# Altium project Auto Plant Controller V2 - SMT_MCU.PrjPcb
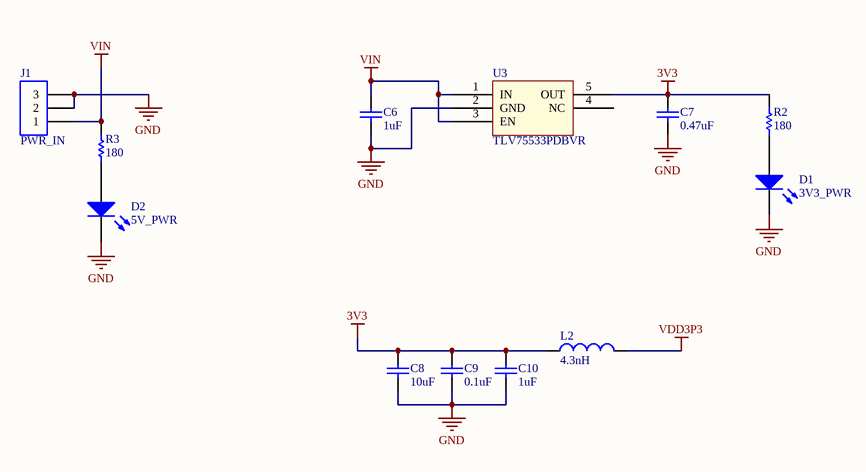
[diagram p0: Vreg.SchDoc]
5 sheets, 51 parts. Net scope: global (net labels, ports and power ports of the same name join across sheets).
Sheets:
  Vreg.SchDoc
  ESP8285.SchDoc
  ADC_MUX.SchDoc
  WifiAntenna.SchDoc
  Connectors.SchDoc

## Sheet Vreg.SchDoc
size A

### Parts
C6  1uF  [C0805]
C7  0.47uF  [CAPC1608X90X35ML15T15]
C8  10uF  [PCB-3l8viaoeo84t9gm70k7i-1]
C9  0.1uF  [PCB-oygqt4xf3sesynjclq4r-1]
C10  1uF  [C0805]
D1  3V3_PWR  [PCB-1544848-1]
D2  5V_PWR  [DIOM1608X06N]
J1  PWR_IN  [ADAM-ADC-002-3_V]
L2  4.3nH  [PCB-vetezry5jn2cqs6s1af8-1]
R2  180  [RESC2013X60X30NL20T20]
R3  180  [RESC2013X60X30NL20T20]
U3  TLV75533PDBVR  [PCB-9xapb279xxlk04njnstk-1]

### Nets
3V3: C7.2 C8.2 C9.2 C10.1 L2.1 R2.2 U3.5(OUT)
GND: C6.2 C7.1 C8.1 C9.1 C10.2 D1.2(K) D2.K J1.2 J1.3 U3.2(GND)
VDD3P3: L2.2
VIN: C6.1 J1.1 R3.2 U3.1(IN) U3.3(EN)
NetD1_1: D1.1(A) R2.1
NetD2_A: D2.A R3.1

Not connected (* = marked no-connect by the designer): U3 4(NC)

### Library data of the parts
C6 C10 = CMP-77c3bc4dc880a804-3: 0805 1 uF 25 V ±10 % Tolerance X7R SMT Multilayer Ceramic Capacitor; Manufacturer Part Number: CC0805KKX7R8BB105; Lead-Free Status: Lead Free; Voltage Rating (DC): 25.0 V; Capacitance Tolerance: ±10%; Octopart Url: http://octopart.com/cc0805kkx7r8bb105-yageo-42244645; Seller Landing  Url: https://octopart-clicks.com/click/track?country=US&ak=8157f166&sig=04b9cde&sid=5489&ppid=42244645&vpid=127579773&ct=offers; Number of Pins: 2; Mounting Style: Surface Mount; Packaging: Cut Tape (CT); Case/Package: 0805; REACH SVHC Compliance: No SVHC; RoHS: Compliant; Halogen Free Status: Halogen Free; Capacitance: 1uF; OctopartID: 77c3bc4dc880a804; Dielectric Characteristic: X7R
C7 = CMP-55ff9c78cd6f8a38-1: CL10 Series 0.47 uF 16 V ±10 % Tolerance X7R SMT Multilayer Ceramic Capacitor; RoHS: Compliant
C8 = CMP-5e7a9647d7d381bd-6: Cap Ceramic 10uF 25V X5R 10% SMD 0805 85C Paper T/R; Manufacturer Part Number: TMK212BBJ106KG-T; Octopart URL: http://octopart.com/tmk212bbj106kg-t-taiyo+yuden-20425935; Dielectric Characteristic: X5R
C9 = CMP-2758844-5: 0.1uF, ±10%, 50V, X7R, 0805, Multilayer Ceramic Capacitor; Manufacturer Part Number: CL21B104KBCNNNC; Lead-Free Status: Lead Free; Voltage Rating (DC): 50.0 V; Capacitance: 100 nF; Operating Temperature: -55.0 °C (min); RoHS: Compliant; Octopart URL: https://octopart.com/cl21b104kbcnnnc-samsung-9299352; Mounting Style: Surface Mount; Case/Package: 0805; Dielectric Characteristic: X7R; OctopartID: 94265da154d84be1
D1 = CMP-1f66d74e5acac0a1-1: Blue 1.6 x 0.8 x 0.3 mm 130° Clear 180 mcd 3.8 V Surface Mount LED; Manufacturer Part Number: LTST-C194TBKT; Lead-Free Status: Lead Free; Case/Package: 0603; Packaging: Reel
D2 = CMP-1544848-9: LED; SMD; 0603; red; 18-54mcd; 1.6x0.8x0.55mm; 130°; 2÷2.4V; 20mA; Wavelength: 639 nm; Case/Package (SI): 1608; Luminous Intensity: 54.0 mcd; Lead-Free Status: Lead Free; Color: Red; RoHS: Compliant; Packaging: Tape & Reel (TR), Cut Tape (CT); Operating Temperature: 85.0 °C (max); Mounting Style: Surface Mount, Vertical; Viewing Angle: 130 °; Size-Height: 550 µm
J1 = CMP-3153101-9: DC Power Connectors DC POWER JACK 2.5MM PIN TYPE 002; Manufacturer Part Number: ADC-002-2; Octopart Url: https://octopart.com/adc-002-2-adam+tech-55509430; OctopartID: 975d5d18b38d489a; Orientation: Right Angle
L2 = CMP-e5012c7543d03ac6-1: Surface Mount High Frequency Inductor, LQW15AN Series, 4.3 nH, 0.1nH, 0402 [1005 Metric], 10 GHz; Manufacturer Part Number: LQW15AN4N3B00D; Lead-Free Status: Lead Free; Inductance: 4.30 nH; Lifecycle Status: Active; Octopart URL: http://octopart.com/lqw15an4n3b00d-murata-8291255; Packaging: Cut Tape (CT); Case/Package: 0402, 1005; RoHS: Compliant; REACH SVHC Compliance: No SVHC; OctopartID: e5012c7543d03ac6
R2 R3 = CMP-3657049-2: Thick Film Resistors - SMD 1/8watts 180ohms 1%; Manufacturer Part Number: RK73H2ATTD1800F; Lead-Free Status: Lead Free; Power Rating: 0.125 W; Resistance: 180.0 Ω; Case/Package: 0805; Mounting Style: Surface Mount; Octopart Url: https://octopart.com/rk73h2attd1800f-koa+speer-15007961; OctopartID: af1966f68aa670de; Resistance Tolerance: ±1%; RoHS: Compliant
U3 = CMP-a508697234f37acf-1: 500-mA low-IQ small-size low-dropout (LDO) regulator 5-SOT-23 -40 to 125; Quiescent Current: 25.0 µA; Output Capacitor Type: Ceramic; Dropout Voltage: 220 mV; Number of Regulated Outputs: 1; Case/Package: SOT-23; Lifecycle Status: Pre-Release; Octopart URL: https://octopart.com/tlv75533pdbvr-texas+instruments-91272349; OctopartID: a508697234f37acf; Operating Temperature: -40.0 °C to 125 °C; RoHS: Compliant; Number of Pins: 5; Manufacturer Part Number: TLV75533PDBVR

## Sheet ESP8285.SchDoc
size A; SheetNumber: 1
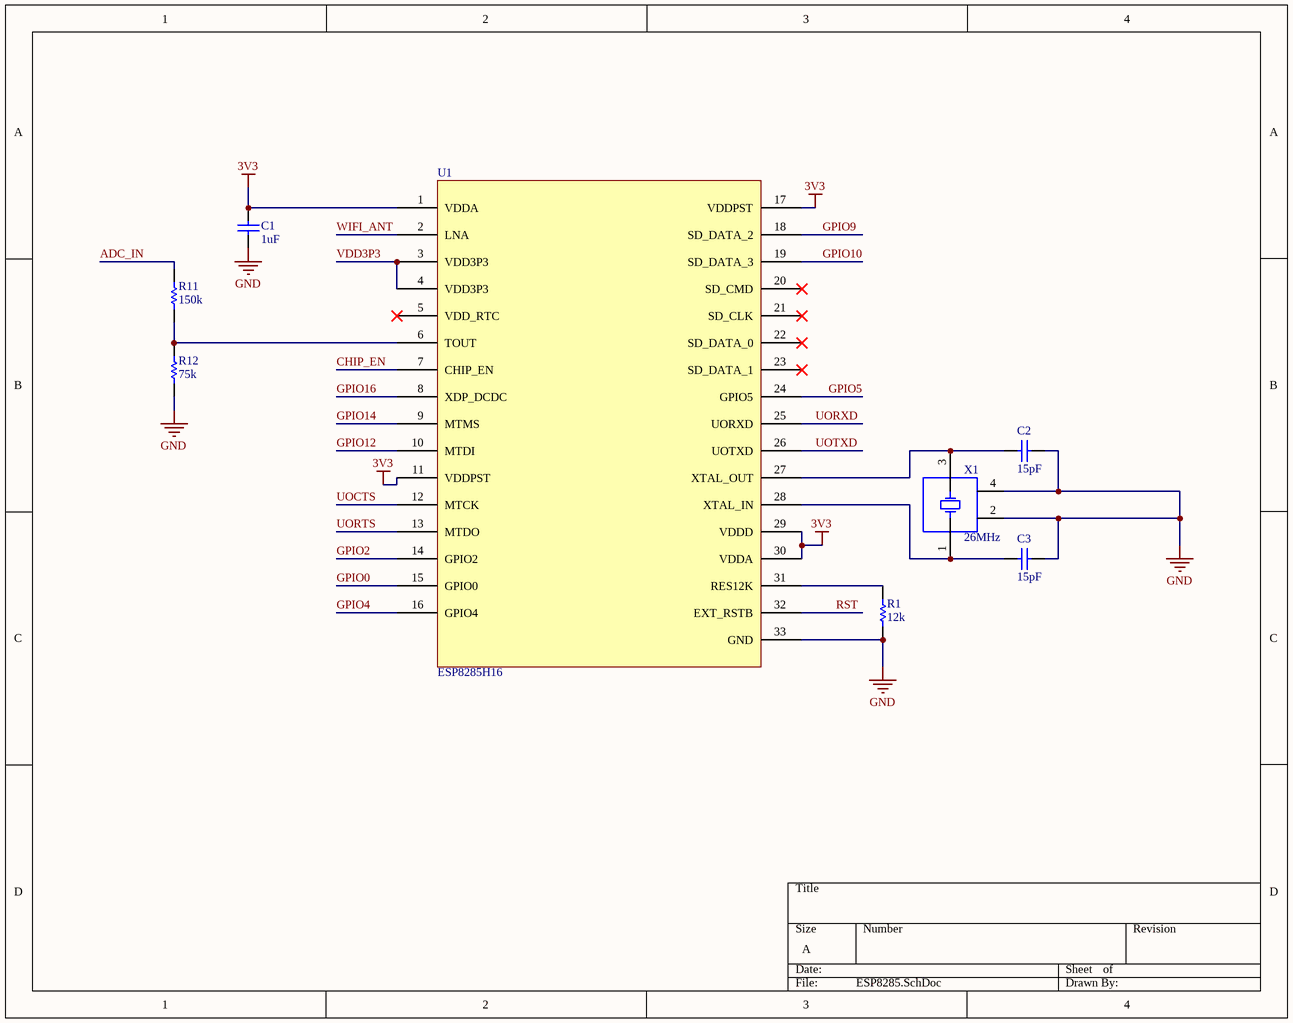
[diagram p1: ESP8285.SchDoc]

### Parts
C1  1uF  [C0805]
C2  15pF  [PCB-98fz84kwkqgd8opjlb99-1]
C3  15pF  [PCB-98fz84kwkqgd8opjlb99-1]
R1  12k  [RESC1609X50X30LL10T20]
R11  150k  [RESC1608X55X30LL15T15]
R12  75k  [RESC1608X55X30LL15T15]
U1  ESP8285H16  [PCB-1fh2hqe1x48mh17li7t6-1]
X1  26MHz  [PCB-1zhjv6m1p58g6yr6i7sc-1]

### Nets
3V3: C1.1 U1.1(VDDA) U1.11(VDDPST) U1.17(VDDPST) U1.29(VDDD) U1.30(VDDA)
GND: C1.2 C2.2 C3.2 R1.1 R12.1 U1.33(GND) X1.2 X1.4
VDD3P3: U1.3(VDD3P3) U1.4(VDD3P3)
ADC_IN: R11.2
CHIP_EN: U1.7(CHIP_EN)
GPIO0: U1.15(GPIO0)
GPIO2: U1.14(GPIO2)
GPIO4: U1.16(GPIO4)
GPIO5: U1.24(GPIO5)
GPIO9: U1.18(SD_DATA_2)
GPIO10: U1.19(SD_DATA_3)
GPIO12: U1.10(MTDI)
GPIO14: U1.9(MTMS)
GPIO16: U1.8(XDP_DCDC)
RST: U1.32(EXT_RSTB)
UOCTS: U1.12(MTCK)
UORTS: U1.13(MTDO)
UORXD: U1.25(UORXD)
UOTXD: U1.26(UOTXD)
WIFI_ANT: U1.2(LNA)
NetC2_1: C2.1 U1.27(XTAL_OUT) X1.3
NetC3_1: C3.1 U1.28(XTAL_IN) X1.1
NetR1_2: R1.2 U1.31(RES12K)
NetR11_1: R11.1 R12.2 U1.6(TOUT)

Not connected (* = marked no-connect by the designer): U1 5(VDD_RTC)* 20(SD_CMD)* 21(SD_CLK)* 22(SD_DATA_0)* 23(SD_DATA_1)*

### Library data of the parts
C1 = CMP-77c3bc4dc880a804-3: as C6 on sheet Vreg; Octopart Url: http://octopart.com/cc0805kkx7r8bb105-yageo-42244645; Seller Landing  Url: https://octopart-clicks.com/click/track?country=US&ak=8157f166&sig=04b9cde&sid=5489&ppid=42244645&vpid=127579773&ct=offers; Number of Pins: 2; Mounting Style: Surface Mount; Packaging: Cut Tape (CT); Case/Package: 0805; REACH SVHC Compliance: No SVHC; RoHS: Compliant; Halogen Free Status: Halogen Free; Capacitance: 1uF; OctopartID: 77c3bc4dc880a804; Dielectric Characteristic: X7R
C2 C3 = CMP-a0ab688c22207f6c-1: 15pF ±1% 50V C0G, NP0 Ceramic Capacitor -55°C ~ 125°C Surface Mount, MLCC 0402 (1005 Metric) 0.039" L x 0.020" W (1.00mm x 0.50mm); Manufacturer Part Number: GRM1555C1H150FA01D; Manufacturer: Murata Electronics North America; Vendor Part Number: 490-6200-1-ND; Manufacturer Part Number, Other: 490-6200-1; Category: Capacitors; Family: Digikey; Capacitance: 15pF; Cost: Ceramic Capacitors; Tolerance: ±1%; Thickness (Max): 0.022" (0.55mm); Octopart URL: http://octopart.com/grm1555c1h150fa01d-murata-19769325; OctopartID: a0ab688c22207f6c; Operating Temperature: -55°C ~ 125°C; Size / Dimension: 0.039" L x 0.020" W (1.00mm x 0.50mm); Temperature Coefficien: C0G, NP0; Mounting Type: Surface Mount, MLCC; Applications: General Purpose; Package / Case: 0402 (1005 Metric); Voltage - Rated: 50V
R1 = CMP-1857522-10: Res Thick Film 0603 12K Ohm 1% 0.1W(1/10W) ±100ppm/C Molded SMD Automotive Paper T/R
R11 = CMP-3654711-2: Thick Film Resistors - SMD 0603 150Kohms 1% Tol; Manufacturer Part Number: ERJ-3EKF1503V; Lead-Free Status: Lead Free; Power Rating: 0.1 W; Resistance: 150000.0 Ω; Voltage Rating (DC): 75.0 V; Case/Package: 0603; Lifecycle Status: Not Listed by Manufacturer; Mounting Style: Surface Mount; Number of Pins: 2; Octopart Url: https://octopart.com/erj-3ekf1503v-panasonic-55421489; OctopartID: de4c140b511b018b; REACH SVHC Compliance: No SVHC; Resistance Tolerance: ±1%; RoHS: Compliant; Size-Height: 0.00045 m; Size-Length: 0.0016 m; Size-Width: 0.0008 m
R12 = CMP-3654871-2: Thick Film Resistors - SMD 0603 75Kohms 1% Tol; Manufacturer Part Number: ERJ-3EKF7502V; Lead-Free Status: Lead Free; Power Rating: 0.1 W; Resistance: 75000.0 Ω; Voltage Rating (DC): 75.0 V; Case/Package: 0603; Lifecycle Status: Not Listed by Manufacturer; Mounting Style: Surface Mount; Octopart Url: https://octopart.com/erj-3ekf7502v-panasonic-55421908; OctopartID: 327df83abccfedba; Packaging: Cut Tape (CT); REACH SVHC Compliance: No SVHC; Resistance Tolerance: ±1%; RoHS: Compliant; Size-Height: 0.00045 m; Size-Length: 0.0016 m; Size-Width: 0.0008 m
U1 = CMP-265ae9019d32f99d-2: RF Transceiver 64QAM/BPSK/CCK/DSSS/OFDM 2.7V to 3.6V 2400MHz to 2483.5MHz 32-Pin QFN; Manufacturer Part Number: ESP8285H16; OctopartID: 265ae9019d32f99d; Octopart URL: https://octopart.com/esp8285h16-espressif+systems-106012174
X1 = CMP-932d5a23796e4cea-3: Crystal 26MHz ±10ppm (Tol) ±10ppm (Stability) 10pF FUND 50Ohm 4-Pin CSMD T/R; Manufacturer Part Number: ABM8-26.000MHZ-10-1-U-T; Frequency: 26.0 MHz; Packaging: Cut Tape (CT); Size-Length: 3.20 mm

## Sheet ADC_MUX.SchDoc
size A
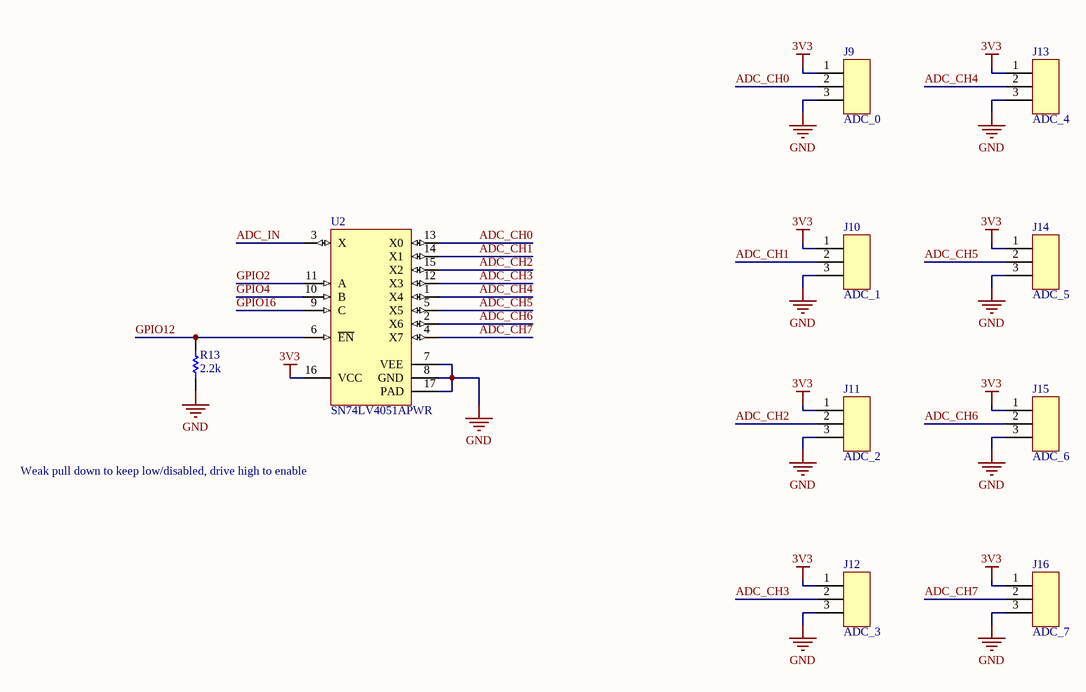
[diagram p2: ADC_MUX.SchDoc]

### Parts
J9  ADC_0  [PCB-s0hfil65plaomi4ibvcw-1]
J10  ADC_1  [PCB-s0hfil65plaomi4ibvcw-1]
J11  ADC_2  [PCB-s0hfil65plaomi4ibvcw-1]
J12  ADC_3  [PCB-s0hfil65plaomi4ibvcw-1]
J13  ADC_4  [PCB-s0hfil65plaomi4ibvcw-1]
J14  ADC_5  [PCB-s0hfil65plaomi4ibvcw-1]
J15  ADC_6  [PCB-s0hfil65plaomi4ibvcw-1]
J16  ADC_7  [PCB-s0hfil65plaomi4ibvcw-1]
R13  2.2k  [PCB-2t5lv6a742zfbi3344hk-1]
U2  SN74LV4051APWR  [PCB-s2tlwx05pg4l7j3eq4ax-1]

### Nets
3V3: J9.1 J10.1 J11.1 J12.1 J13.1 J14.1 J15.1 J16.1 U2.16(VCC)
GND: J9.3 J10.3 J11.3 J12.3 J13.3 J14.3 J15.3 J16.3 R13.1 U2.7(VEE) U2.8(GND) U2.17(PAD)
ADC_CH0: J9.2 U2.13(X0)
ADC_CH1: J10.2 U2.14(X1)
ADC_CH2: J11.2 U2.15(X2)
ADC_CH3: J12.2 U2.12(X3)
ADC_CH4: J13.2 U2.1(X4)
ADC_CH5: J14.2 U2.5(X5)
ADC_CH6: J15.2 U2.2(X6)
ADC_CH7: J16.2 U2.4(X7)
ADC_IN: U2.3(X)
GPIO2: U2.11(A)
GPIO4: U2.10(B)
GPIO12: R13.2 U2.6(~{EN})
GPIO16: U2.9(C)

### Notes on the sheet
- Weak pull down to keep low/disabled, drive high to enable

### Library data of the parts
J9-J16 = CMP-8a90426ffa175557-34: THT Vertical Pin Header WR-PHD, Pitch 2.54 mm, Single Row, 3 pins; Lead-Free Status: Lead Free; Dielectric Withstanding Voltage: 500 V; Orientation: Vertical
R13 = CMP-ce770211389311b0-1: Res, AEC-Q200, Thick Film, 2K2, 5%, 0603; Manufacturer Part Number: CRGCQ0603J2K2; Lifecycle Status: Not Listed by Manufacturer; Octopart URL: https://octopart.com/crgcq0603j2k2-te+connectivity-91018114; Packaging: Cut Tape (CT); Resistance Tolerance: ±5%; OctopartID: ce770211389311b0
U2 = CMP-2f9ae6973f1af05d-4: 5-V, 8: 1, 1-channel general-purpose analog multiplexer 16-TSSOP -40 to 85; Number of Circuits: 1; Polarity: Non-Inverting; Supply Current: 20.0 µA; Number of Channels: 8; Bandwidth: 35.0 MHz; Propagation Delay Max (tpd): 7.00 ns; Voltage Nodes: 5.00 V, 3.30 V, 2.50 V; Lead-Free Status: Lead Free; Quiescent Current: 20.0 µA (max); Supply Voltage (DC): 2.00 V to 5.50 V; OctopartID: 2f9ae6973f1af05d; Operating Temperature: 85.0 °C (max); Number of Pins: 16; Case/Package: TSSOP; Packaging: Cut Tape (CT), Tape & Reel (TR); REACH SVHC Compliance: No SVHC; Lifecycle Status: Active; Number of Bits: 8; RoHS: Compliant; Manufacturer Part Number: SN74LV4051APWR; Mounting Style: Surface Mount; Octopart URL: https://octopart.com/sn74lv4051apwr-texas+instruments-472550

## Sheet WifiAntenna.SchDoc
size A
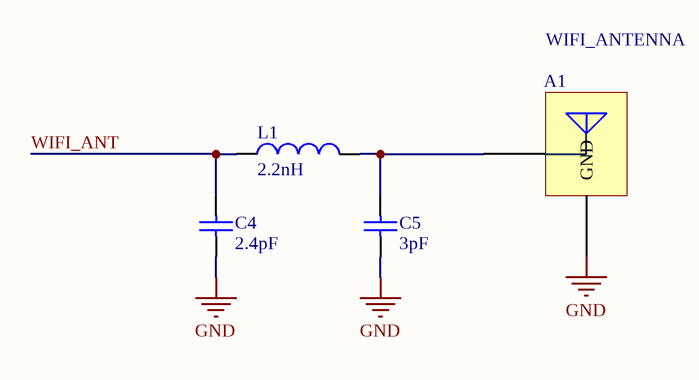
[diagram p3: WifiAntenna.SchDoc]

### Parts
A1  WIFI_ANTENNA  [PCB-wx81mnio3p969u8b8u4u-1]
C4  2.4pF  [CAPC1005X55X25ML05T10]
C5  3pF  [CAPC1005X55X25ML05T10]
L1  2.2nH  [PCB-vg5vda2wcniu3fh2gltx-1]

### Nets
GND: A1.2(GND) C4.1 C5.1
WIFI_ANT: C4.2 L1.1
NetA1_1: A1.1(A) C5.2 L1.2

### Library data of the parts
A1 = CMP-nvfputv9e4hvqhxbgt68-5: Meandered Inverted-F Antenna; CustomComponentID: nvfputv9e4hvqhxbgt68
C4 = CMP-119517-2: CAP CER 2.4PF 50V NP0 0402; Manufacturer Part Number: GJM1555C1H2R4CB01D; Capacitance: 2.4e-12 F; Dielectric Characteristic: C0G/NP0; Lead-Free Status: Lead Free; Voltage Rating (DC): 50.0 V; Mounting Style: Surface Mount; Octopart Url: https://octopart.com/gjm1555c1h2r4cb01d-murata-196712; OctopartID: 662aaf234324b9ed; RoHS: Compliant; Size-Height: 0.0005 m; Size-Length: 0.001 m; Size-Thickness: 0.0005 m; Size-Width: 0.0005 m
C5 = CMP-2512733-2: Multilayer Ceramic Capacitors MLCC - SMD/SMT 0402 3.0pF 50volts C0G +/-0.25pF; Manufacturer Part Number: GRM1555C1H3R0CA01D; Capacitance: 3e-12 F; Dielectric Characteristic: C0G/NP0; Lead-Free Status: Lead Free; Voltage Rating (DC): 50.0 V; Lifecycle Status: Active; Octopart Url: https://octopart.com/grm1555c1h3r0ca01d-murata-15748360; OctopartID: 3ee4f71e568ae123; REACH SVHC Compliance: No SVHC; RoHS: Compliant; Size-Length: 0.001 m; Size-Thickness: 0.0005 m; Size-Width: 0.0005 m
L1 = CMP-80494860bc425f8e-1: Inductor RF Chip Thin Film 2.2nH 0.1nH 500MHz 14Q-Factor 600mA 150mOhm DCR 0201 Paper T/R; Manufacturer Part Number: LQP03TN2N2B02D; Inductance: 2.20 nH; Packaging: Cut Tape (CT); Octopart URL: https://octopart.com/lqp03tn2n2b02d-murata-19077485; Lifecycle Status: Active

## Sheet Connectors.SchDoc
size A
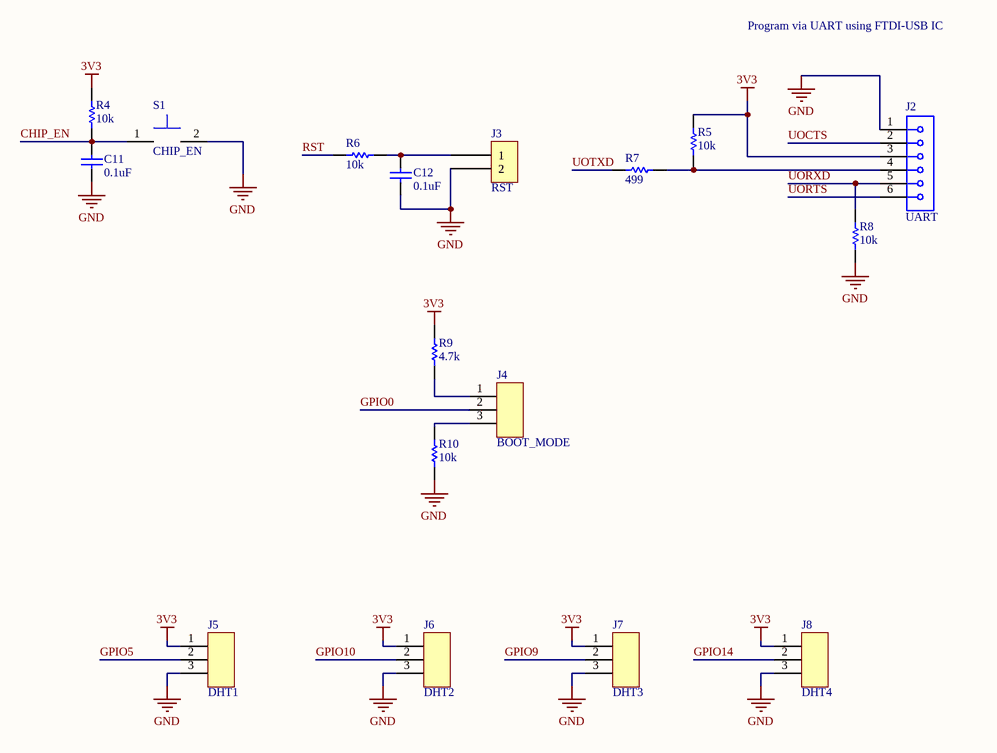
[diagram p4: Connectors.SchDoc]

### Parts
C11  0.1uF  [PCB-oygqt4xf3sesynjclq4r-1]
C12  0.1uF  [PCB-oygqt4xf3sesynjclq4r-1]
J2  UART  [PCB-di8nzhz8ya7afv8i1myi-1]
J3  RST  [Jumper]
J4  BOOT_MODE  [PCB-s0hfil65plaomi4ibvcw-1]
J5  DHT1  [PCB-s0hfil65plaomi4ibvcw-1]
J6  DHT2  [PCB-s0hfil65plaomi4ibvcw-1]
J7  DHT3  [PCB-s0hfil65plaomi4ibvcw-1]
J8  DHT4  [PCB-s0hfil65plaomi4ibvcw-1]
R4  10k  [PCB-urbe6pl2f36u5sj9z9e0-1]
R5  10k  [PCB-urbe6pl2f36u5sj9z9e0-1]
R6  10k  [PCB-urbe6pl2f36u5sj9z9e0-1]
R7  499  [RESC1609X50X30ML10T20]
R8  10k  [PCB-urbe6pl2f36u5sj9z9e0-1]
R9  4.7k  [RESC1608X55X30ML20T10]
R10  10k  [PCB-urbe6pl2f36u5sj9z9e0-1]
S1  CHIP_EN  [PCB-xzcf6rj7v3ysitq80b7l-1]

### Nets
3V3: J2.3 J5.1 J6.1 J7.1 J8.1 R4.2 R5.1 R9.2
GND: C11.1 C12.1 J2.1 J3.2 J5.3 J6.3 J7.3 J8.3 R8.2 R10.2 S1.2
CHIP_EN: C11.2 R4.1 S1.1
GPIO0: J4.2
GPIO5: J5.2
GPIO9: J7.2
GPIO10: J6.2
GPIO14: J8.2
RST: R6.2
UOCTS: J2.2
UORTS: J2.6
UORXD: J2.5 R8.1
UOTXD: R7.1
NetC12_2: C12.2 J3.1 R6.1
NetJ2_4: J2.4 R5.2 R7.2
NetJ4_1: J4.1 R9.1
NetJ4_3: J4.3 R10.1

### Notes on the sheet
- Program via UART using FTDI-USB IC

### Library data of the parts
C11 C12 = CMP-2758844-5: as C9 on sheet Vreg; Operating Temperature: -55.0 °C (min); RoHS: Compliant; Octopart URL: https://octopart.com/cl21b104kbcnnnc-samsung-9299352; Mounting Style: Surface Mount; Case/Package: 0805; Dielectric Characteristic: X7R; OctopartID: 94265da154d84be1
J2 = CMP-ea272149382c35e0-4: Conn; Rect; UnshroudedHdr; 6Cnts; ThruHole; BergStik; 2.54mmPin-Spng; Vert; 1-Row
J3 = CMP-08fac3900112d73d-14: 2 pin male header straight tht; Number of Positions: 2; Contact Plating: Gold; Mounting Style: Through Hole, Solder; Material: Thermoplastic
J4-J8 = CMP-8a90426ffa175557-34: as J9 on sheet ADC_MUX; Orientation: Vertical
R4-R6 R8 R10 = CMP-1974d512ef63c6b3-1: Res, AEC-Q200, Thick Film, 10K, 5%, 0603; Manufacturer Part Number: CRGCQ0603J10K; Packaging: Cut Tape (CT); Resistance Tolerance: ±5%; Lifecycle Status: Not Listed by Manufacturer; OctopartID: 1974d512ef63c6b3; Octopart URL: https://octopart.com/crgcq0603j10k-te+connectivity-91018097
R7 = CMP-3835606-2: Res Thick Film 0603 499 Ohm 1% 1/10W ±100ppm/C Molded SMD Paper T/R; Manufacturer Part Number: CRCW0603499RFKEA; Lead-Free Status: Lead Free; Power Rating: 0.1 W; Resistance: 499.0 Ω; Temperature Coefficient: 100.0 ppm/°C; Voltage Rating (DC): 75.0 V; Case/Package: 0603; Mounting Style: Surface Mount; Number of Pins: 2; Octopart Url: https://octopart.com/crcw0603499rfkea-vishay-39781368; OctopartID: 6f40a41549deb087; REACH SVHC Compliance: No SVHC; Resistance Tolerance: ±1%; RoHS: Compliant; Size-Height: 0.00045 m; Size-Length: 0.00155 m; Size-Width: 0.00085 m
R9 = CMP-2823469-2: Res Thick Film 0603 4.7K Ohm 5% 0.1W(1/10W) ±200ppm/C Molded SMD Automotive Punched Paper T/R; Manufacturer Part Number: RK73B1JTTD472J; Lead-Free Status: Lead Free; Resistance: 4700.0 Ω; Temperature Coefficient: 200.0 ppm/°C; Voltage Rating (DC): 50.0 V; Case/Package: 0603; Mounting Style: Surface Mount; Octopart Url: https://octopart.com/rk73b1jttd472j-koa+speer-2166243; OctopartID: de05172ef68001c2; Power Rating: 0.1 W; Resistance Tolerance: ±5%; RoHS: Compliant; Size-Length: 0.0016 m; Size-Width: 0.0008 m
S1 = CMP-32abff024869ed6c-2: Switch Tactile Spst-No 0.02a 15v

## Nets that join several sheets
3V3: Vreg (7 pins), ESP8285 (6 pins), ADC_MUX (9 pins), Connectors (8 pins)
GND: Vreg (10 pins), ESP8285 (8 pins), ADC_MUX (12 pins), WifiAntenna (A1.2 C4.1 C5.1), Connectors (11 pins)
VDD3P3: Vreg (L2.2), ESP8285 (U1.3 U1.4)
ADC_IN: ESP8285 (R11.2), ADC_MUX (U2.3)
CHIP_EN: ESP8285 (U1.7), Connectors (C11.2 R4.1 S1.1)
GPIO0: ESP8285 (U1.15), Connectors (J4.2)
GPIO2: ESP8285 (U1.14), ADC_MUX (U2.11)
GPIO4: ESP8285 (U1.16), ADC_MUX (U2.10)
GPIO5: ESP8285 (U1.24), Connectors (J5.2)
GPIO9: ESP8285 (U1.18), Connectors (J7.2)
GPIO10: ESP8285 (U1.19), Connectors (J6.2)
GPIO12: ESP8285 (U1.10), ADC_MUX (R13.2 U2.6)
GPIO14: ESP8285 (U1.9), Connectors (J8.2)
GPIO16: ESP8285 (U1.8), ADC_MUX (U2.9)
RST: ESP8285 (U1.32), Connectors (R6.2)
UOCTS: ESP8285 (U1.12), Connectors (J2.2)
UORTS: ESP8285 (U1.13), Connectors (J2.6)
UORXD: ESP8285 (U1.25), Connectors (J2.5 R8.1)
UOTXD: ESP8285 (U1.26), Connectors (R7.1)
WIFI_ANT: ESP8285 (U1.2), WifiAntenna (C4.2 L1.1)